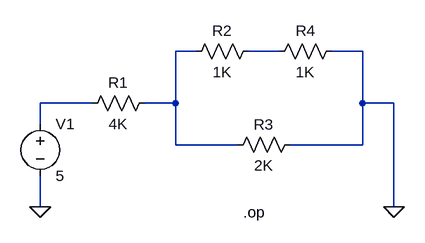
[diagram p0: schematic Kirchhoff.asc]
Kirchhoff.asc, the LTspice schematic file:
Version 4
SHEET 1 880 680
WIRE 224 80 192 80
WIRE 352 80 304 80
WIRE 480 80 432 80
WIRE 64 160 -16 160
WIRE 192 160 192 80
WIRE 192 160 144 160
WIRE 480 160 480 80
WIRE 528 160 480 160
WIRE -16 192 -16 160
WIRE 192 224 192 160
WIRE 288 224 192 224
WIRE 480 224 480 160
WIRE 480 224 368 224
WIRE -16 320 -16 272
WIRE 528 320 528 160
FLAG -16 320 0
FLAG 528 320 0
SYMBOL res 160 144 R90
WINDOW 0 0 56 VBottom 2
WINDOW 3 32 56 VTop 2
SYMATTR InstName R1
SYMATTR Value 4K
SYMBOL res 320 64 R90
WINDOW 0 0 56 VBottom 2
WINDOW 3 32 56 VTop 2
SYMATTR InstName R2
SYMATTR Value 1K
SYMBOL res 384 208 R90
WINDOW 0 0 56 VBottom 2
WINDOW 3 32 56 VTop 2
SYMATTR InstName R3
SYMATTR Value 2K
SYMBOL res 448 64 R90
WINDOW 0 0 56 VBottom 2
WINDOW 3 32 56 VTop 2
SYMATTR InstName R4
SYMATTR Value 1K
SYMBOL voltage -16 176 R0
WINDOW 123 0 0 Left 0
WINDOW 39 0 0 Left 0
SYMATTR InstName V1
SYMATTR Value 5
TEXT 296 328 Left 2 !.op

The netlist it stands for:
* Kirchhoff.asc
R1 N001 N003 4K
R2 N002 N001 1K
R3 0 N001 2K
R4 0 N002 1K
V1 N003 0 5
.op
.backanno
.end